# Altium schematic sheet Top.SchDoc
size 420 x 297 mm; SheetNumber: 1; SheetTotal: 21
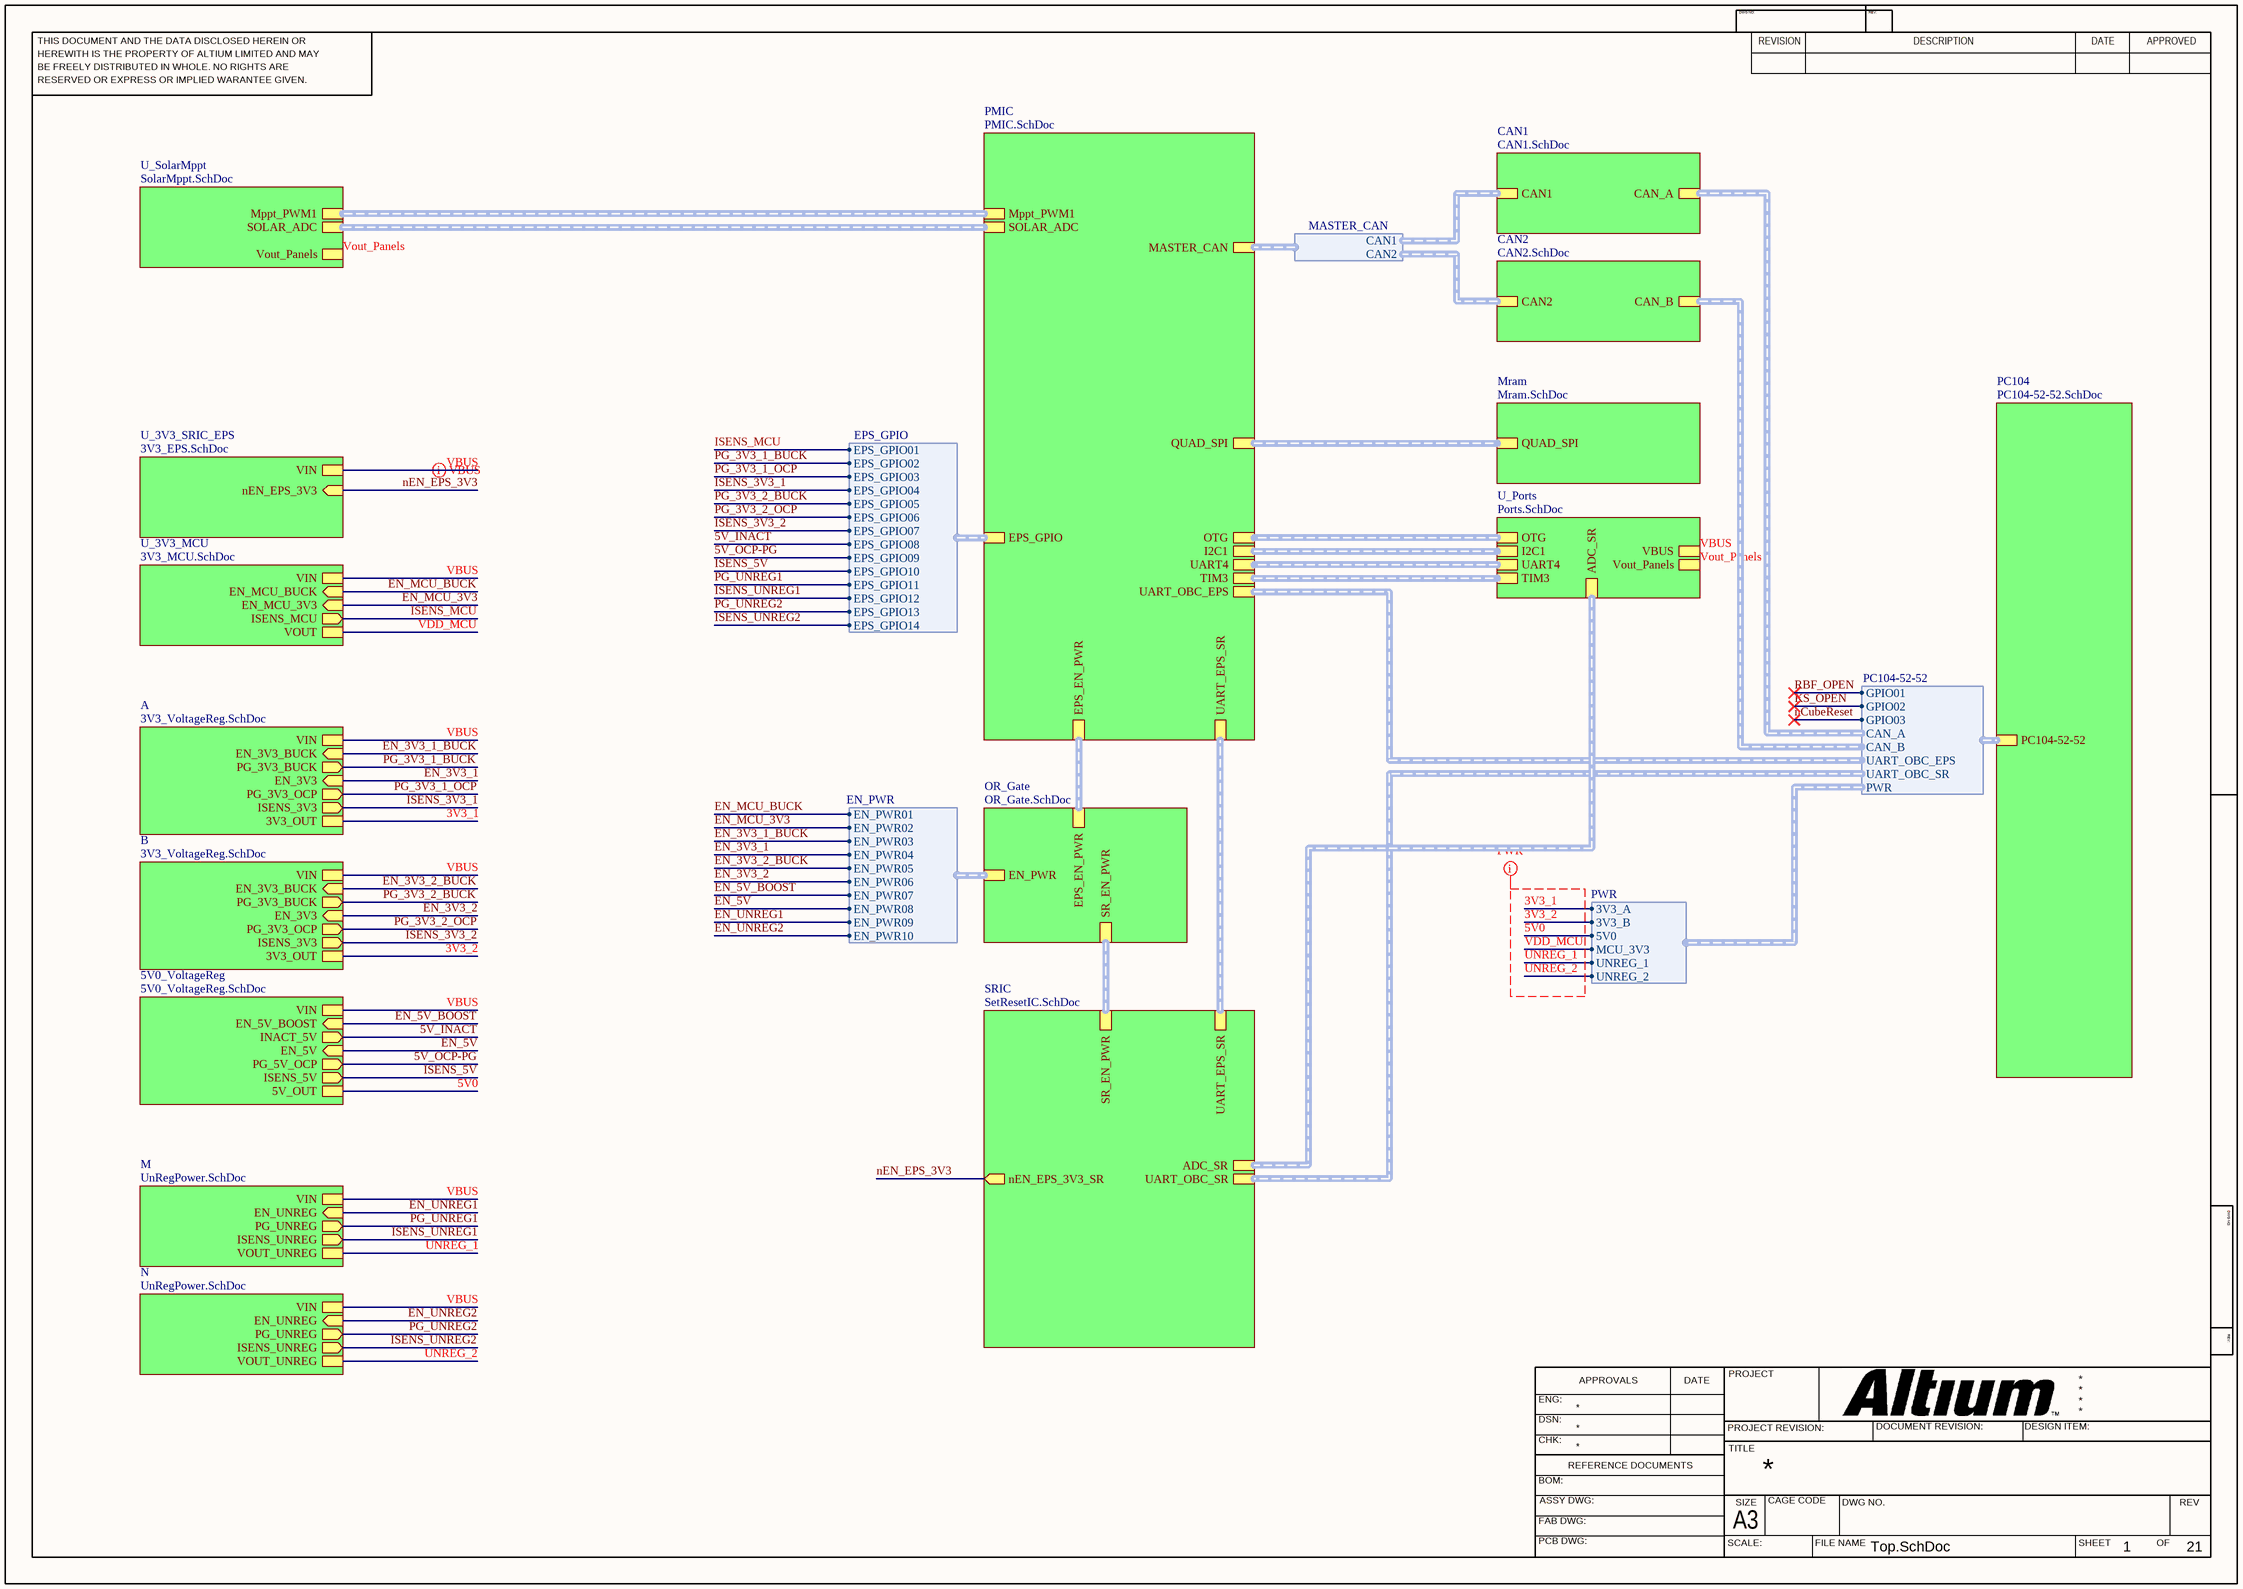
[diagram p0: Top.SchDoc]

## Sub-sheets
5V0_VoltageReg = 5V0_VoltageReg.SchDoc: EN_5V (in), EN_5V_BOOST (in), PG_5V_OCP (out), INACT_5V (out), ISENS_5V (out), 5V_OUT, VIN
A = 3V3_VoltageReg.SchDoc: EN_3V3 (in), EN_3V3_BUCK (in), PG_3V3_BUCK (out), PG_3V3_OCP (out), ISENS_3V3 (out), 3V3_OUT, VIN
B = 3V3_VoltageReg.SchDoc: EN_3V3 (in), EN_3V3_BUCK (in), PG_3V3_BUCK (out), PG_3V3_OCP (out), ISENS_3V3 (out), 3V3_OUT, VIN
CAN1 = CAN1.SchDoc: CAN_A (harness CAN_A), CAN1 (harness CAN1)
CAN2 = CAN2.SchDoc: CAN_B (harness CAN_b), CAN2 (harness CAN2)
M = UnRegPower.SchDoc: EN_UNREG (in), PG_UNREG (out), ISENS_UNREG (out), VOUT_UNREG, VIN
Mram = Mram.SchDoc: QUAD_SPI (harness QUAD_SPI)
N = UnRegPower.SchDoc: EN_UNREG (in), PG_UNREG (out), ISENS_UNREG (out), VOUT_UNREG, VIN
OR_Gate = OR_Gate.SchDoc: EPS_EN_PWR (harness EPS_EN_PWR), SR_EN_PWR (harness SR_EN_PWR), EN_PWR (harness EN_PWR)
PC104 = PC104-52-52.SchDoc: PC104-52-52 (harness PC104-52-52)
PMIC = PMIC.SchDoc: MASTER_CAN (harness MASTER_CAN), QUAD_SPI (harness QUAD_SPI), EPS_EN_PWR (harness EPS_EN_PWR), EPS_GPIO (harness EPS_GPIO), UART4 (harness UART4), SOLAR_ADC (harness SOLAR_ADC), Mppt_PWM1 (harness Mppt_PWM), UART_EPS_SR (harness UART_EPS_SR), UART_OBC_EPS (harness UART_OBC_EPS), I2C1 (harness I2C1), OTG (harness OTG), TIM3 (harness TIM3)
SRIC = SetResetIC.SchDoc: UART_OBC_SR (harness UART_OBC_SR), SR_EN_PWR (harness SR_EN_PWR), UART_EPS_SR (harness UART_EPS_SR), nEN_EPS_3V3_SR (out), ADC_SR (harness ADC_SR)
U_3V3_MCU = 3V3_MCU.SchDoc: EN_MCU_3V3 (in), EN_MCU_BUCK (in), ISENS_MCU (out), VIN, VOUT
U_3V3_SRIC_EPS = 3V3_EPS.SchDoc: nEN_EPS_3V3 (in), VIN
U_Ports = Ports.SchDoc: UART4 (harness UART4), I2C1 (harness I2C1), OTG (harness OTG), TIM3 (harness TIM3), VBUS, Vout_Panels, ADC_SR (harness ADC_SR)
U_SolarMppt = SolarMppt.SchDoc: SOLAR_ADC (harness SOLAR_ADC), Mppt_PWM1 (harness Mppt_PWM), Vout_Panels

## Harnesses
MASTER_CAN: CAN1, CAN2
EN_PWR: EN_PWR01, EN_PWR02, EN_PWR03, EN_PWR04, EN_PWR05, EN_PWR06, EN_PWR07, EN_PWR08, EN_PWR09, EN_PWR10
EPS_GPIO: EPS_GPIO01, EPS_GPIO02, EPS_GPIO03, EPS_GPIO04, EPS_GPIO05, EPS_GPIO06, EPS_GPIO07, EPS_GPIO08, EPS_GPIO09, EPS_GPIO10, EPS_GPIO11, EPS_GPIO12, EPS_GPIO13, EPS_GPIO14
PWR: 3V3_A, 3V3_B, 5V0, MCU_3V3, UNREG_1, UNREG_2
PC104-52-52: GPIO01, GPIO02, GPIO03, CAN_A, CAN_B, PWR, UART_OBC_EPS, UART_OBC_SR

## Nets
3V3_1: sheet A/3V3_OUT, harness PWR.3V3_A
3V3_2: sheet B/3V3_OUT, harness PWR.3V3_B
5V0: sheet 5V0_VoltageReg/5V_OUT, harness PWR.5V0
5V_INACT: sheet 5V0_VoltageReg/INACT_5V, sheet PMIC/EPS_GPIO.EPS_GPIO08
5V_OCP-PG: sheet 5V0_VoltageReg/PG_5V_OCP, sheet PMIC/EPS_GPIO.EPS_GPIO09
EN_3V3_1: sheet A/EN_3V3, sheet OR_Gate/EN_PWR.EN_PWR04
EN_3V3_1_BUCK: sheet A/EN_3V3_BUCK, sheet OR_Gate/EN_PWR.EN_PWR03
EN_3V3_2: sheet B/EN_3V3, sheet OR_Gate/EN_PWR.EN_PWR06
EN_3V3_2_BUCK: sheet B/EN_3V3_BUCK, sheet OR_Gate/EN_PWR.EN_PWR05
EN_5V: sheet 5V0_VoltageReg/EN_5V, sheet OR_Gate/EN_PWR.EN_PWR08
EN_5V_BOOST: sheet 5V0_VoltageReg/EN_5V_BOOST, sheet OR_Gate/EN_PWR.EN_PWR07
EN_MCU_3V3: sheet U_3V3_MCU/EN_MCU_3V3, sheet OR_Gate/EN_PWR.EN_PWR02
EN_MCU_BUCK: sheet U_3V3_MCU/EN_MCU_BUCK, sheet OR_Gate/EN_PWR.EN_PWR01
EN_UNREG1: sheet M/EN_UNREG, sheet OR_Gate/EN_PWR.EN_PWR09
EN_UNREG2: sheet N/EN_UNREG, sheet OR_Gate/EN_PWR.EN_PWR10
ISENS_3V3_1: sheet A/ISENS_3V3, sheet PMIC/EPS_GPIO.EPS_GPIO04
ISENS_3V3_2: sheet B/ISENS_3V3, sheet PMIC/EPS_GPIO.EPS_GPIO07
ISENS_5V: sheet 5V0_VoltageReg/ISENS_5V, sheet PMIC/EPS_GPIO.EPS_GPIO10
ISENS_MCU: sheet U_3V3_MCU/ISENS_MCU, sheet PMIC/EPS_GPIO.EPS_GPIO01
ISENS_UNREG1: sheet M/ISENS_UNREG, sheet PMIC/EPS_GPIO.EPS_GPIO12
ISENS_UNREG2: sheet N/ISENS_UNREG, sheet PMIC/EPS_GPIO.EPS_GPIO14
KS_OPEN: sheet PC104/PC104-52-52.GPIO02
nCubeReset: sheet PC104/PC104-52-52.GPIO03
nEN_EPS_3V3: sheet U_3V3_SRIC_EPS/nEN_EPS_3V3, sheet SRIC/nEN_EPS_3V3_SR
PG_3V3_1_BUCK: sheet A/PG_3V3_BUCK, sheet PMIC/EPS_GPIO.EPS_GPIO02
PG_3V3_1_OCP: sheet A/PG_3V3_OCP, sheet PMIC/EPS_GPIO.EPS_GPIO03
PG_3V3_2_BUCK: sheet B/PG_3V3_BUCK, sheet PMIC/EPS_GPIO.EPS_GPIO05
PG_3V3_2_OCP: sheet B/PG_3V3_OCP, sheet PMIC/EPS_GPIO.EPS_GPIO06
PG_UNREG1: sheet M/PG_UNREG, sheet PMIC/EPS_GPIO.EPS_GPIO11
PG_UNREG2: sheet N/PG_UNREG, sheet PMIC/EPS_GPIO.EPS_GPIO13
RBF_OPEN: sheet PC104/PC104-52-52.GPIO01
UNREG_1: sheet M/VOUT_UNREG, harness PWR.UNREG_1
UNREG_2: sheet N/VOUT_UNREG, harness PWR.UNREG_2
VBUS: sheet A/VIN, sheet 5V0_VoltageReg/VIN, sheet U_3V3_MCU/VIN, sheet U_3V3_SRIC_EPS/VIN, sheet M/VIN, sheet U_Ports/VBUS, sheet B/VIN, sheet N/VIN
VDD_MCU: sheet U_3V3_MCU/VOUT, harness PWR.MCU_3V3
Vout_Panels: sheet U_Ports/Vout_Panels, sheet U_SolarMppt/Vout_Panels

## Buses and harness runs
harness sheet Mram/QUAD_SPI = sheet PMIC/QUAD_SPI
harness sheet OR_Gate/EPS_EN_PWR = sheet PMIC/EPS_EN_PWR
harness sheet OR_Gate/SR_EN_PWR = sheet SRIC/SR_EN_PWR
harness sheet PMIC/I2C1 = sheet U_Ports/I2C1
harness sheet PMIC/Mppt_PWM1 = sheet U_SolarMppt/Mppt_PWM1
harness sheet PMIC/OTG = sheet U_Ports/OTG
harness sheet PMIC/SOLAR_ADC = sheet U_SolarMppt/SOLAR_ADC
harness sheet PMIC/TIM3 = sheet U_Ports/TIM3
harness sheet PMIC/UART4 = sheet U_Ports/UART4
harness sheet PMIC/UART_EPS_SR = sheet SRIC/UART_EPS_SR
harness sheet SRIC/ADC_SR = sheet U_Ports/ADC_SR

## Layout directives
net class PWR: 3V3_1, 3V3_2, 5V0, UNREG_1, UNREG_2, VDD_MCU
mark named VBUS: VBUS

## Notes on the sheet
- THIS DOCUMENT AND THE DATA DISCLOSED HEREIN OR
- HEREWITH IS THE PROPERTY OF ALTIUM LIMITED AND MAY
- DWG NO:
- REVISION
- REV:
- DESCRIPTION
- DATE
- APPROVED
- BE FREELY DISTRIBUTED IN WHOLE. NO RIGHTS ARE
- RESERVED OR EXPRESS OR IMPLIED WARANTEE GIVEN.
- ENG:
- APPROVALS
- PROJECT
- DSN:
- CHK:
- REFERENCE DOCUMENTS
- PROJECT REVISION:
- TITLE
- DOCUMENT REVISION:
- DESIGN ITEM:
- BOM:
- FAB DWG:
- PCB DWG:
- ASSY DWG:
- SCALE:
- A3
- SIZE
- CAGE CODE
- FILE NAME
- DWG NO.
- SHEET
- OF
- REV